# Altium schematic sheet Filter.SchDoc
size 114 x 127 mm; SheetNumber: 4; SheetTotal: 5
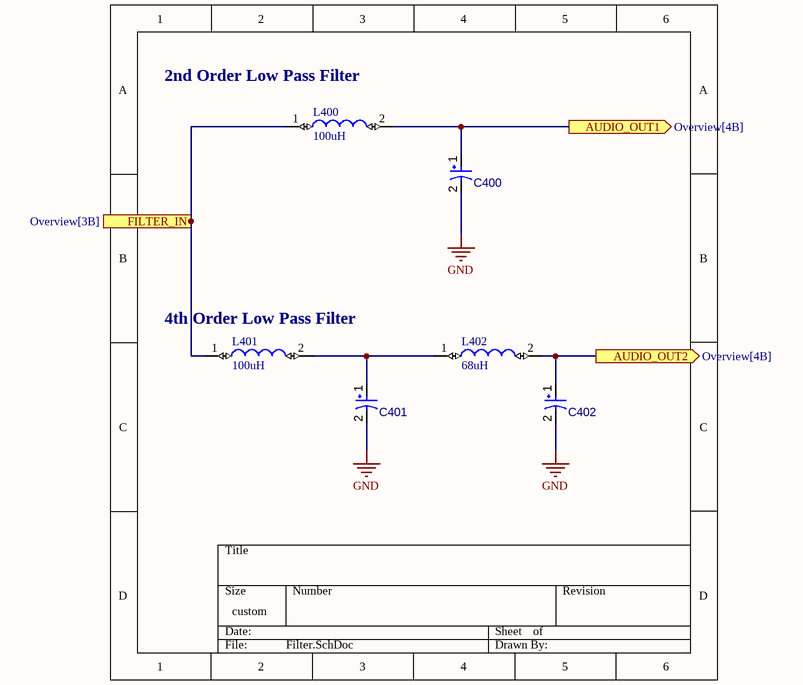
[diagram p0: Filter.SchDoc]

## Parts
C400  630nF  [CAPPR65-500-1600X1000X1700]  (value not drawn)
C401  1.5uF  [CAPPR65-500-1600X1000X1700]  (value not drawn)
C402  390nF  [CAPPR65-500-1600X1000X1700]  (value not drawn)
L400  100uH  [RLB0914]
L401  100uH  [RLB0914]
L402  68uH  [RLB0914]

## Ports
AUDIO_OUT1 (out, see Overview[4B]), AUDIO_OUT2 (out, see Overview[4B]), FILTER_IN (in, see Overview[3B])

## Nets
GND: C400.2 C401.2 C402.2
AUDIO_OUT1: C400.1 L400.2 ; port AUDIO_OUT1
AUDIO_OUT2: C402.1 L402.2 ; port AUDIO_OUT2
FILTER_IN: L400.1 L401.1 ; port FILTER_IN
NetC401_1: C401.1 L401.2 L402.1

## Notes on the sheet
- (near L400) 2nd Order Low Pass Filter
- (near L401) 4th Order Low Pass Filter

## Library data of the parts
C400-C402 = CMP-001-00034-7: Manufacturer: Panasonic; Capacitor Type: Electrolytic; Voltage Rating: 100V; Tolerance: 20%; Value: 100µF; Ripple Current: 350mA; Mounting Technology: TH; Case/Package: Radial; Pins: 2; RoHS Compliant: True; Min Operating Temperature: -40°C; Max Operating Temperature: 85°C; Ripple Current (AC): 350mA; Package Quantity: 200; Package Description: 2-Pin Through Hole Device, Dia 10 mm, Body Length 16 mm; Package Reference: CAPPR65-500-1600X1000X1700; Datasheet URL: https://industrial.panasonic.com/cdbs/www-data/pdf/RDF0000/ABA0000C1047.pdf; Manufacturer URL: http://www.panasonic.com/; Packaging: Bulk; Datasheet Version: Mar-16; Diameter: 10mm; Lead Pitch: 5mm
L400-L402 = RLB0914-101KL: 100uH Through Hole Inductor; Manufacturer_Name: Bourns; Datasheet Link: https://componentsearchengine.com/Datasheets/2/RLB0914-101KL.pdf; Manufacturer_Part_Number: RLB0914-101KL; Mouser Part Number: 652-RLB0914-101KL; Mouser Price/Stock: https://www.mouser.co.uk/ProductDetail/Bourns/RLB0914-101KL?qs=AC4ivEYFOTDvh%252BZyhliaeA%3D%3D; Arrow Part Number: RLB0914-101KL; Arrow Price/Stock: https://www.arrow.com/en/products/rlb0914-101kl/bourns?region=europe